# EAGLE design 011 (EAGLE 9.6.2)
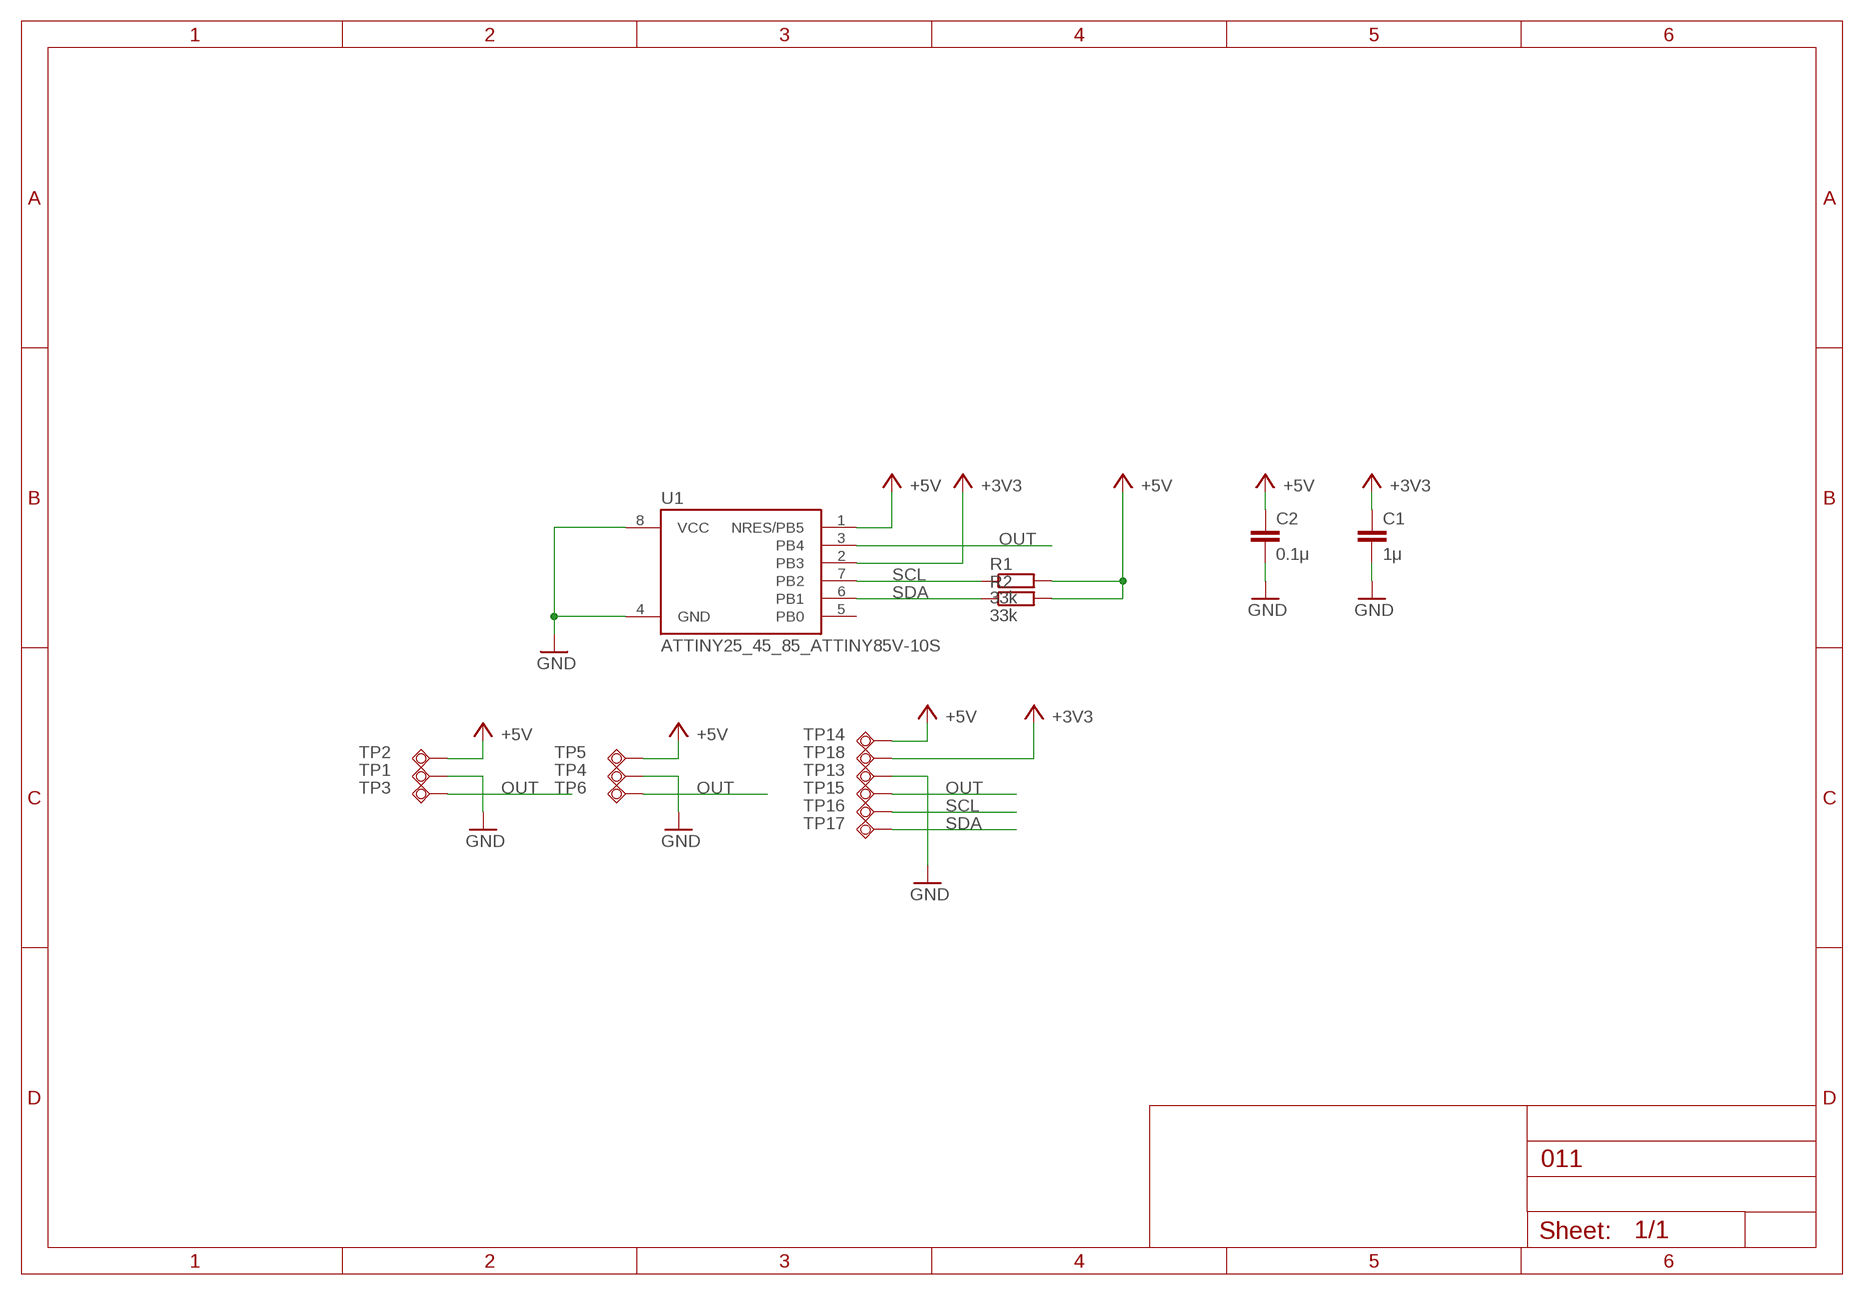
[diagram p0: schematic, sheet 1]

## Parts
C1  1μ  C-EUC0603  [C0603]
C2  0.1μ  C-EUC0603  [C0603]
R1  33k  R-EU_R0603  [R0603]
R2  33k  R-EU_R0603  [R0603]
TP1  TPSQTP11R  [TP11R]
TP2  TPSQTP11SQ  [TP11SQ]
TP3  TPSQTP11R  [TP11R]
TP4  TPSQTP11R  [TP11R]
TP5  TPSQTP11SQ  [TP11SQ]
TP6  TPSQTP11R  [TP11R]
TP13  TPSQTP11R  [TP11R]
TP14  TPSQTP11SQ  [TP11SQ]
TP15  TPSQTP11R  [TP11R]
TP16  TPSQTP11R  [TP11R]
TP17  TPSQTP11R  [TP11R]
TP18  TPSQTP11R  [TP11R]
U1  ATTINY25_45_85_ATTINY85V-10S  [ATTINY25_45_85_SOIC8_EIAJ_208MIL]

## Nets
+3V3: C1.1 TP18.TP U1.2(PB3)
+5V: C2.1 R1.2 R2.2 TP2.TP TP5.TP TP14.TP U1.1(NRES/PB5)
GND: C1.2 C2.2 TP1.TP TP4.TP TP13.TP U1.4(GND) U1.8(VCC)
OUT: TP3.TP TP6.TP TP15.TP U1.3(PB4)
SCL: R1.1 TP16.TP U1.7(PB2)
SDA: R2.1 TP17.TP U1.6(PB1)
Unconnected: U1.5(PB0)

## Library data of the parts
C1 C2 = rcl:C-EU: CAPACITOR, European symbol; SPICEPREFIX: C
R1 R2 = rcl:R-EU_: RESISTOR, European symbol; SPICEPREFIX: R
TP1-TP6 TP13-TP18 = testpad:TPSQ: Test pad
U1 = #002-CPU:ATTINY25_45_85_ATTINY85*: ATMEL ATtiny 85 Packages: P = PDIP 08 30mil S = SOIC 08 EIAJ 208mil Technologies Note: for complete ordering code (temp. range, finish, tape&reel etc.) see www.atmel.com • Supply Voltage: V = (1.8…5.5)V | [blank] = (2.7…5.5)V • Speed: 10 = 10 MHz | 20 = 20 MHz Author: Dipl.-Ing. FH Rainer Bayer HHN Hochschule Heilbronn (Heilbronn University), rainer.bayer@hs-heilbronn.de Ingenieurbüro ing-rb, mail@ing-rb.de

## Net classes
0 default: width 0.381 mm

## Board
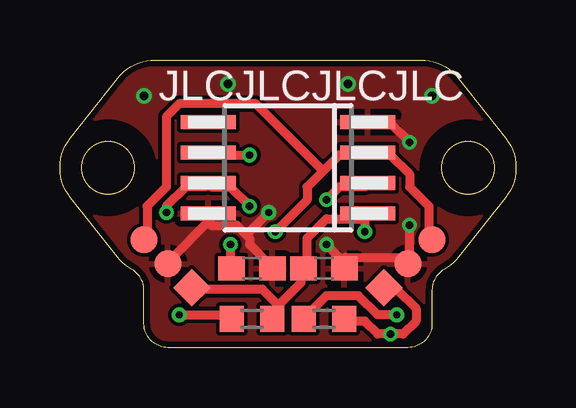
[diagram p1: board, top side]
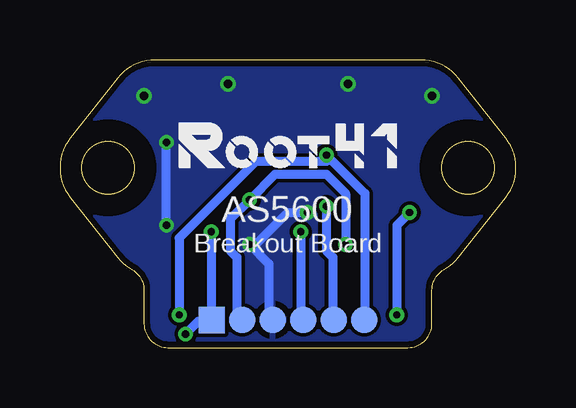
[diagram p2: board, bottom side, seen from below]

Size 19 x 12 mm. Coordinates in mm from the lower left corner, seen from the top.
Outline: 4.5,0 arc-90 3.5,1 3.5,2.38 arc61 2.99,3.26 arc-22 2.4,3.76 0.43,6.26 arc-76 0.43,8.74 2.4,11.24 arc-52 3.97,12 15.03,12 arc-52 16.6,11.24 18.57,8.74 arc-76 18.57,6.26 16.6,3.76 arc-22 16.01,3.26 arc61 15.5,2.38 15.5,1 arc-90 14.5,0 4.5,0
Outline: circle at 17,7.5 radius 1.1
Outline: circle at 2,7.5 radius 1.1
Copper layers (1*16): Top 0.035mm / dielectric 1.5mm / Bottom 0.035mm
Design rules "SeeedStudio_2layer_DRU_no_angle_20140221": minimum track width 6mil, minimum drill 12mil, track to track 6mil, track to pad 6mil, pad to pad 6mil, via to via 6mil, smd to smd 0mil, copper to edge 10mil, drill to drill 10mil, minimum pad ring 10mil, minimum via ring 6mil, stop-mask expansion 2mil, vias tented up to drill 100mil, thermal gap 10mil
tRestrict: area 15,5.5 to 19,9.5; area 0,5.5 to 4,9.5
bRestrict: area 15,5.5 to 19,9.5; area 0,5.5 to 4,9.5

### Footprints (pad centres in the part's own frame; a part is rotated, then mirrored left to right if it is on the bottom)
C0603 = smd 1.1 x 1: 1 -0.85,0; 2 0.85,0
R0603 = smd 1 x 1.1: 1 -0.85,0; 2 0.85,0
TP11R = smd 1.1 x 1.1: TP 0,0
TP11SQ = smd 1.1 x 1.1: TP 0,0
ATTINY25_45_85_SOIC8_EIAJ_208MIL = smd 0.6 x 2.286: 1 -1.905,-3.33; 2 -0.635,-3.33; 3 0.635,-3.33; 4 1.905,-3.33; 5 1.905,3.33; 6 0.635,3.33; 7 -0.635,3.33; 8 -1.905,3.33

### Placement (x,y rotation side)
C1  8,3.3 0 top
C2  11,3.3 0 top
R1  8,1.2 0 top
R2  11,1.2 0 top
TP1  4.5,3.5 0 top
TP2  5.5,2.5 45 top
TP3  3.5,4.5 0 top
TP4  14.5,3.5 0 top
TP5  13.5,2.5 225 top
TP6  15.5,4.5 0 top
TP13  10.13,1.15 0 bottom
TP14  12.67,1.15 0 bottom
TP15  8.86,1.15 0 bottom
TP16  7.59,1.15 0 bottom
TP17  6.32,1.15 0 bottom
TP18  11.4,1.15 0 bottom
U1  9.5,7.5 90 top

### Tracks (layer width: path | path; a pad name or v marks a point on that pad's centre or on a via)
+3V3  (via drill 0.3)
  Top 0.381: v11.1,6.17 11.63,6.7 12.7,6.7 U1.2 | v7.1,4.3 7.1,3.5 C1.1
  Bottom 0.381: TP18.TP 11.63,1.37 11.63,3.77 11.9,4.03 11.9,5.37 v11.1,6.17 10.03,7.23 7.9,7.23 7.1,6.43 v7.1,4.3
+5V  (via drill 0.3)
  Top 0.381: R2.2 11.9,1.1 12.7,1.1 13.23,0.57 v13.77,0.57 14.3,0.57 14.83,1.1 14.83,1.63 14.03,2.43 13.5,2.43 TP5.TP | 9.1,1.77 10.03,2.7 10.03,3.23 C2.1 10.3,3.5 10.3,4.57 11.1,5.37 12.7,5.37 | 9.1,1.77 8.97,1.63 8.97,1.37 R1.2 | 9.1,1.77 8.43,2.43 5.77,2.43 TP2.TP | 12.7,5.37 v12.7,4.83 | 12.7,5.37 U1.1
  Bottom 0.381: v13.77,0.57 13.23,1.1 12.7,1.1 TP14.TP 12.7,1.37 v12.7,4.83
GND  (via drill 0.3, 0.35)
  Top 0.381: 6.17,5.23 6.3,5.37 U1.8 | 6.17,5.23 4.7,3.77 TP1.TP | 7.77,4.7 7.37,5.1 6.3,5.1 6.17,5.23 | 7.77,4.7 7.9,4.57 7.9,4.3 8.7,3.5 C1.2 | v11.1,4.3 11.9,3.5 C2.2 11.9,3.77 14.3,3.77 TP4.TP 14.57,3.77 v14.57,5.1 | v14.57,8.57 13.77,9.37 12.97,9.37 U1.4 | v8.7,5.63 7.77,4.7
  Bottom 0.381: TP13.TP 10.3,1.37 10.3,3.5 v11.1,4.3 10.83,4.3 9.5,5.63 v8.7,5.63 | v14.57,5.1 v14.57,8.57
  other vias: 15.5,10.5 3.5,10.5 7,11 12,11
  pour Bottom: -0.5,12.5 19.5,12.5 19.5,-0.5 -0.5,-0.5
  pour Top: -0.5,12.5 19.5,12.5 19.5,-0.5 -0.5,-0.5
OUT  (via drill 0.3)
  Top 0.381: v8.97,4.83 10.3,6.17 10.3,6.7 10.97,7.37 | 10.97,7.37 11.63,8.03 12.7,8.03 U1.3 12.97,8.03 13.77,8.03 14.57,7.23 14.57,6.7 15.37,5.9 15.37,4.57 TP6.TP | 10.97,7.37 8.17,10.17 4.97,10.17 4.43,9.63 4.43,6.7 3.63,5.9 3.63,4.57 TP3.TP
  Bottom 0.381: v8.97,4.83 8.97,1.37 TP15.TP
SCL  (via drill 0.3)
  Top 0.381: v7.9,5.9 7.1,6.7 6.3,6.7 U1.7 6.03,6.7 5.23,6.7 4.43,5.9 v4.43,5.63 | v4.97,1.37 7.1,1.37 R1.1
  Bottom 0.381: v7.9,5.9 7.9,4.03 7.63,3.77 7.63,1.37 TP16.TP | v4.97,1.37 4.97,5.1 v4.43,5.63
SDA  (via drill 0.3)
  Top 0.381: v7.9,8.03 6.3,8.03 U1.6 | v14.03,1.37 13.23,1.37 12.43,2.17 11.1,2.17 10.3,1.37 R2.1
  Bottom 0.381: TP17.TP 6.3,1.37 6.3,6.43 v7.9,8.03 7.9,7.77 10.83,7.77 14.03,4.57 v14.03,1.37

### Text on the board
tPlace: JLCJLCJLCJLC
bPlace: AS5600 | Breakout Board